# EAGLE schematic T06_preliminarySchematic_v3 (EAGLE 7.4.0)
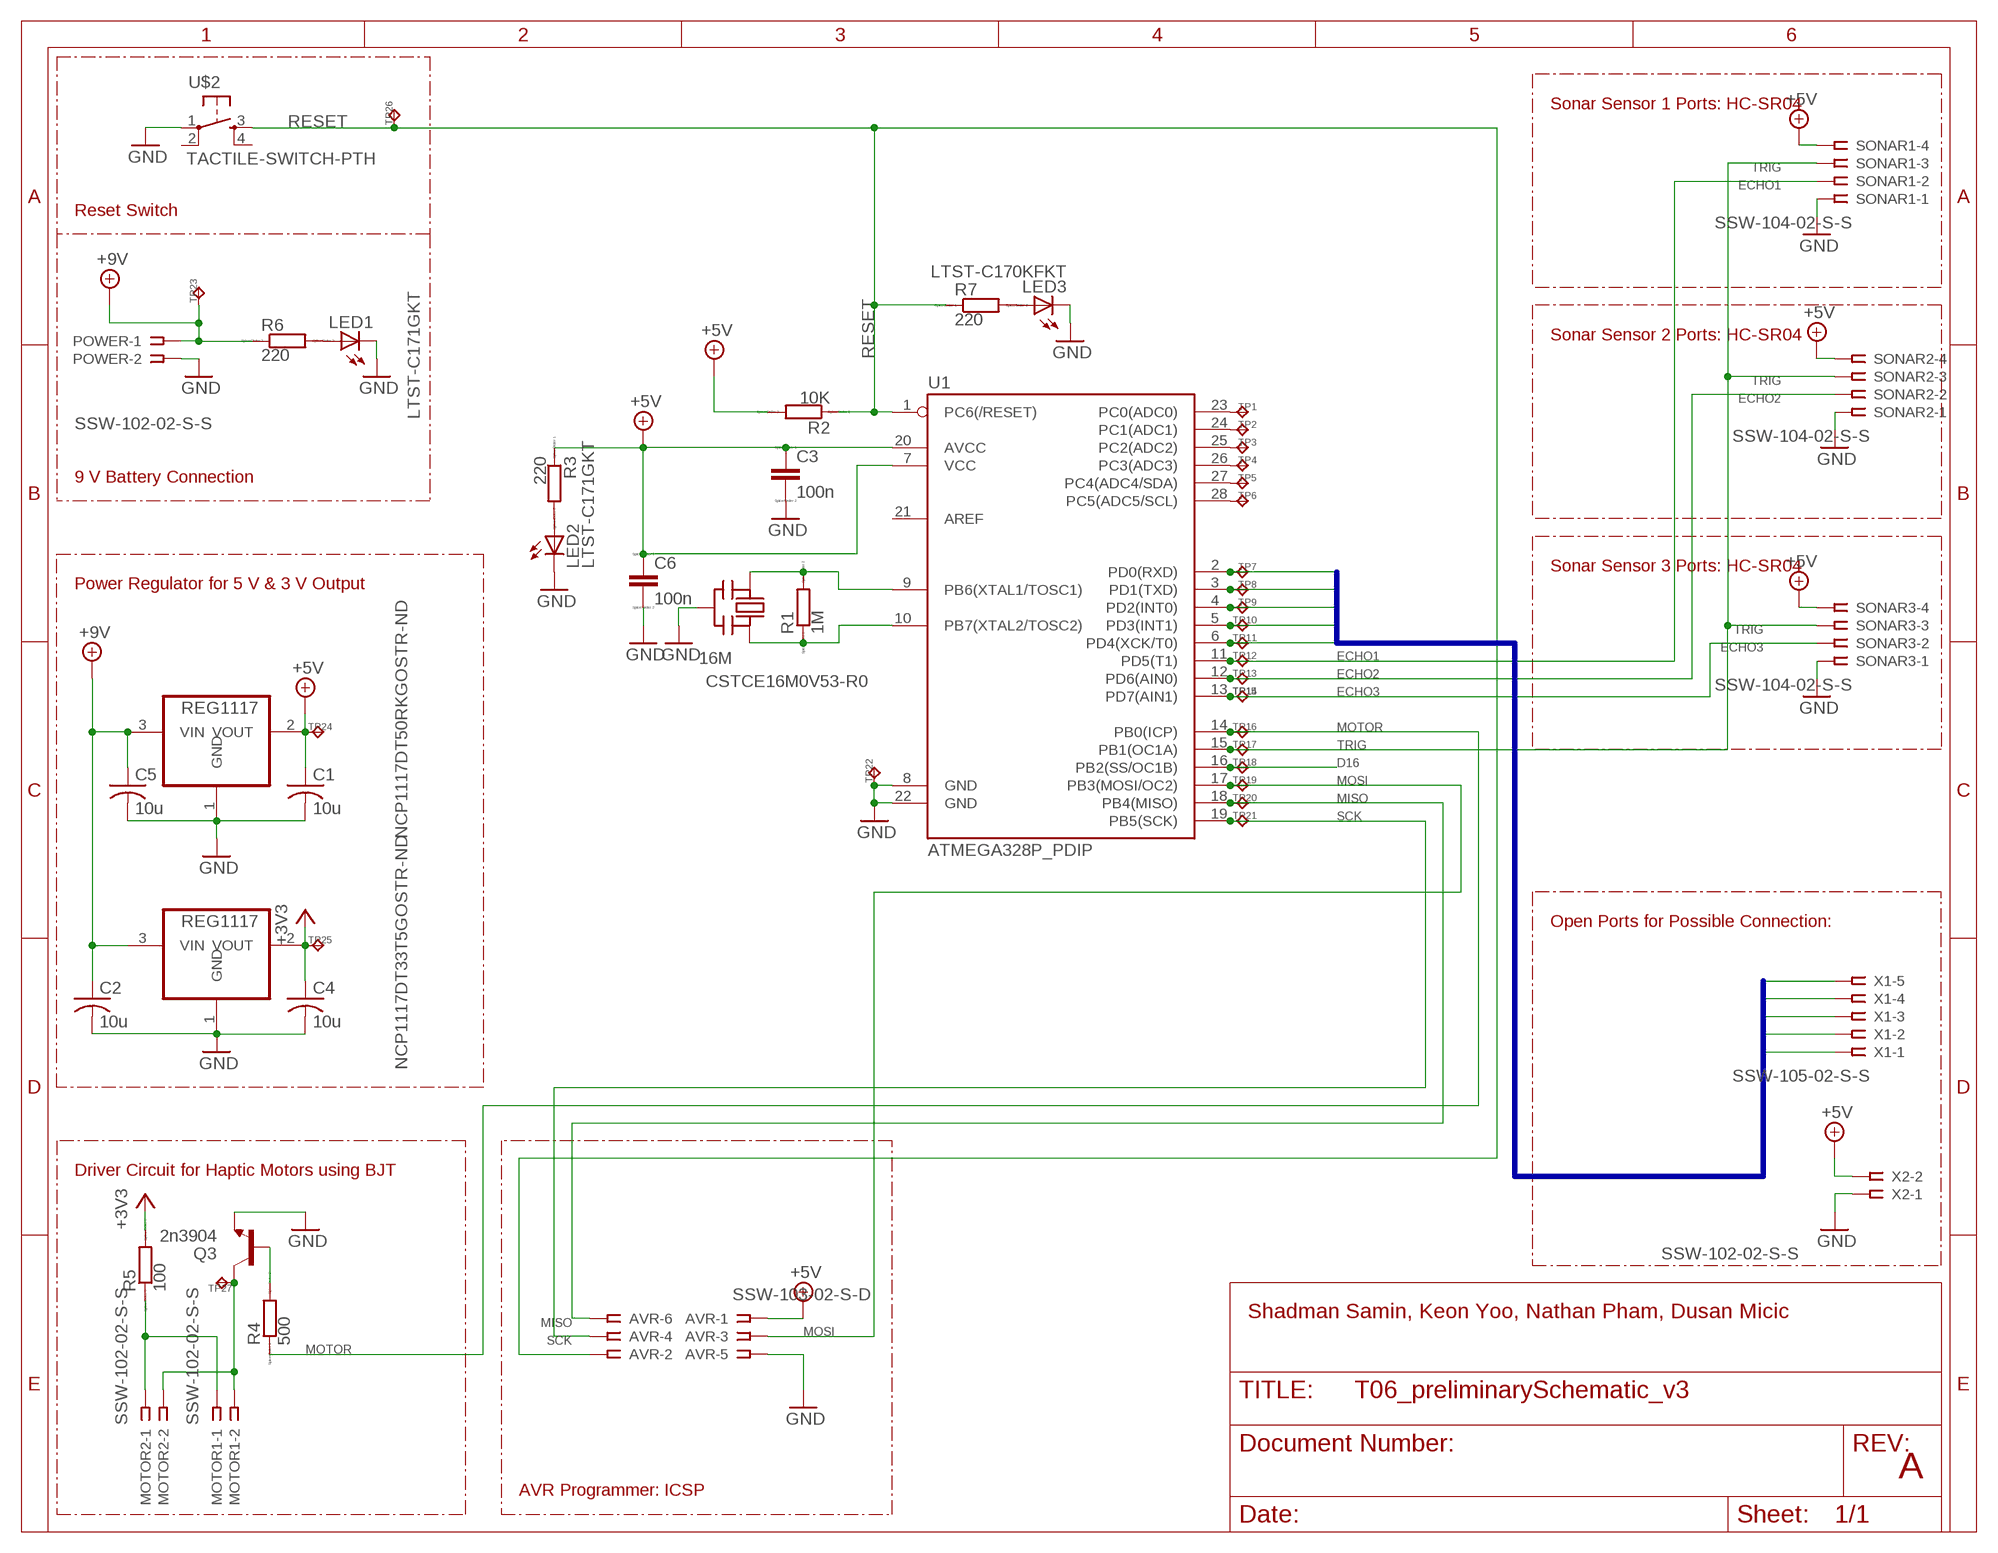
[diagram p0: schematic, sheet 1]

## Parts
AVR  SSW-103-02-S-D  [SSW-103-02-S-D]
C1  10u  C-USC0805K  [C0805K]
C2  10u  C-USC0805K  [C0805K]
C3  100n  CC1005  [C1005]
C4  10u  C-USC0805K  [C0805K]
C5  10u  C-USC0805K  [C0805K]
C6  100n  CC1005  [C1005]
CSTCE16M0V53-R0  16M  CERMOSCILL-CSTCRG  [CSTCR-G]
LED1  LTST-C171GKT  LEDCHIPLED_0805  [CHIPLED_0805]
LED2  LTST-C171GKT  LEDCHIP-LED0805  [CHIP-LED0805]
LED3  LTST-C170KFKT  LEDCHIP-LED0805  [CHIP-LED0805]
MOTOR1  SSW-102-02-S-S  [SSW-102-02-S-S]
MOTOR2  SSW-102-02-S-S  [SSW-102-02-S-S]
NCP1117DT33T5GOSTR-ND  REG1117  [SOT223]
NCP1117DT50RKGOSTR-ND  REG1117  [SOT223]
POWER  SSW-102-02-S-S  [SSW-102-02-S-S]
Q3  2n3904  TRANSISTOR_NPN2N3904  [TO-92]
R1  1M  RR0603  [R0603]
R2  10K  RR0603  [R0603]
R3  220  RR0603  [R0603]
R4  500  RR0603  [R0603]
R5  100  RR0603  [R0603]
R6  220  RR0603  [R0603]
R7  220  RR0603  [R0603]
SONAR1  SSW-104-02-S-S  [SSW-104-02-S-S]
SONAR2  SSW-104-02-S-S  [SSW-104-02-S-S]
SONAR3  SSW-104-02-S-S  [SSW-104-02-S-S]
TP1  TPPAD1-13  [P1-13]
TP2  TPPAD1-13  [P1-13]
TP3  TPPAD1-13  [P1-13]
TP4  TPPAD1-13  [P1-13]
TP5  TPPAD1-13  [P1-13]
TP6  TPPAD1-13  [P1-13]
TP7  TPPAD1-13  [P1-13]
TP8  TPPAD1-13  [P1-13]
TP9  TPPAD1-13  [P1-13]
TP10  TPPAD1-13  [P1-13]
TP11  TPPAD1-13  [P1-13]
TP12  TPPAD1-13  [P1-13]
TP13  TPPAD1-13  [P1-13]
TP14  TPPAD1-13  [P1-13]
TP15  TPPAD1-13  [P1-13]
TP16  TPPAD1-13  [P1-13]
TP17  TPPAD1-13  [P1-13]
TP18  TPPAD1-13  [P1-13]
TP19  TPPAD1-13  [P1-13]
TP20  TPPAD1-13  [P1-13]
TP21  TPPAD1-13  [P1-13]
TP22  TPPAD1-13  [P1-13]
TP23  TPPAD1-13  [P1-13]
TP24  TPPAD1-13  [P1-13]
TP25  TPPAD1-13  [P1-13]
TP26  TPPAD1-13  [P1-13]
TP27  TPPAD1-13  [P1-13]
U1  ATMEGA328P_PDIP  [DIL28-3]
U$2  TACTILE-SWITCH-PTH  [TAC-SWITCH-PTH]
X1  SSW-105-02-S-S  [SSW-105-02-S-S]
X2  SSW-102-02-S-S  [SSW-102-02-S-S]

## Nets
+3V3: C4.1 NCP1117DT33T5GOSTR-ND.2(VOUT) R5.2 TP25.TP
+5V: AVR.1 C1.1 C3.1 C6.1 NCP1117DT50RKGOSTR-ND.2(VOUT) R2.2 R3.1 SONAR1.4 SONAR2.4 SONAR3.4 TP24.TP U1.7(VCC) U1.20(AVCC) X2.2
+9V: C2.1 C5.1 NCP1117DT33T5GOSTR-ND.3(VIN) NCP1117DT50RKGOSTR-ND.3(VIN) POWER.1 R6.1 TP23.TP
BU0: TP7.TP U1.2(PD0(RXD)) X1.1
BU1: TP8.TP U1.3(PD1(TXD)) X1.2
BU2: TP9.TP U1.4(PD2(INT0)) X1.3
BU3: TP10.TP U1.5(PD3(INT1)) X1.4
BU4: TP11.TP U1.6(PD4(XCK/T0)) X1.5
D16: TP18.TP U1.16(PB2(SS/OC1B))
ECHO1: SONAR1.2 TP12.TP U1.11(PD5(T1))
ECHO2: SONAR2.2 TP13.TP U1.12(PD6(AIN0))
ECHO3: SONAR3.2 TP14.TP TP15.TP U1.13(PD7(AIN1))
GND: AVR.5 C1.2 C2.2 C3.2 C4.2 C5.2 C6.2 CSTCE16M0V53-R0.2(GND) LED1.C LED2.C LED3.C NCP1117DT33T5GOSTR-ND.1(GND) NCP1117DT50RKGOSTR-ND.1(GND) POWER.2 Q3.1(E) SONAR1.1 SONAR2.1 SONAR3.1 TP22.TP U1.8(GND) U1.22(GND) U$2.1 X2.1
MISO: AVR.6 TP20.TP U1.18(PB4(MISO))
MOSI: AVR.3 TP19.TP U1.17(PB3(MOSI/OC2))
MOTOR: R4.1 TP16.TP U1.14(PB0(ICP))
N$1: CSTCE16M0V53-R0.3(OUT) R1.1 U1.10(PB7(XTAL2/TOSC2))
N$2: CSTCE16M0V53-R0.1(IN) R1.2 U1.9(PB6(XTAL1/TOSC1))
N$3: TP1.TP U1.23(PC0(ADC0))
N$4: TP2.TP U1.24(PC1(ADC1))
N$5: MOTOR1.1 MOTOR2.1 R5.1
N$6: TP3.TP U1.25(PC2(ADC2))
N$7: LED1.A R6.2
N$8: LED2.A R3.2
N$9: LED3.A R7.2
N$10: Q3.2(B) R4.2
N$11: MOTOR1.2 MOTOR2.2 Q3.3(C) TP27.TP
N$12: TP4.TP U1.26(PC3(ADC3))
N$13: TP5.TP U1.27(PC4(ADC4/SDA))
N$14: TP6.TP U1.28(PC5(ADC5/SCL))
RESET: AVR.2 R2.1 R7.1 TP26.TP U1.1(PC6(/RESET)) U$2.3
SCK: AVR.4 TP21.TP U1.19(PB5(SCK))
TRIG: SONAR1.3 SONAR2.3 SONAR3.3 TP17.TP U1.15(PB1(OC1A))
Unconnected: U1.21(AREF) U$2.2 U$2.4

## Buses
BU[0..4]

## Notes on the sheet
- Sonar Sensor 1 Ports: HC-SR04
- Reset Switch
- Sonar Sensor 2 Ports: HC-SR04
- 9 V Battery Connection
- Sonar Sensor 3 Ports: HC-SR04
- Power Regulator for 5 V & 3 V Output
- Open Ports for Possible Connection:
- Driver Circuit for Haptic Motors using BJT
- Shadman Samin, Keon Yoo, Nathan Pham, Dusan Micic
- A
- AVR Programmer: ICSP

## Library data of the parts
AVR = con-samtec:SSW-103-02-S-D: THROUGH-HOLE .025" SQ POST SOCKET Source: Samtec SSW.pdf; MPN: SSW-103-02-S-D; OC_FARNELL: unknown; OC_NEWARK: 11P9365
C1 C2 C4 C5 = adafruit:C-US: CAPACITOR, American symbol
C3 C6 = eagle-ltspice:C: CAPACITOR, European symbol; SPICEMODEL: NONE; SPICEPREFIX: C
CSTCE16M0V53-R0 = adafruit:CERMOSCILL: Ceramic oscillator with built in capacitors such as ZTT-12MHz http://www.ladyada.net/library/eagle
LED1-LED3 = adafruit:LED: LED OSRAM: - CHIPLED LG R971, LG N971, LY N971, LG Q971, LY Q971, LO R971, LY R971 LH N974, LH R974 LS Q976, LO Q976, LY Q976 LO Q996 - Hyper CHIPLED LW Q18S LB Q993, LB Q99A, LB R99A - SideLED LS A670, LO A670, LY A670, LG A670, LP A670 LB A673, LV A673, LT A673, LW A673 LH A674 LY A675 LS A676, LA A676, LO A676, LY A676, LW A676 LS A679, LY A679, LG A679 - Hyper Micro SIDELED® LS Y876, LA Y876, LO Y876, LY Y876 LT Y87S - SmartLED LW L88C, LW L88S LB L89C, LB L89S, LG L890 LS L89K, LO L89K, LY L89K LS L896, LA L896, LO L896, LY L896 - TOPLED LS T670, LO T670, LY T670, LG T670, LP T670 LSG T670, LSP T670, LSY T670, LOP T670, LYG T670 LG T671, LOG T671, LSG T671 LB T673, LV T673, LT T673, LW T673 LH T674 LS T676, LA T676, LO T676, LY T676, LB T676, LH T676, LSB T676, LW T676 LB T67C, LV T67C, LT T67C, LS T67K, LO T67K, LY T67K, LW E67C LS E67B, LA E67B, LO E67B, LY E67B, LB E67C, LV E67C, LT E67C LW T67C LS T679, LY T679, LG T679 LS T770, LO T770, LY T770, LG T770, LP T770 LB T773, LV T773, LT T773, LW T773 LH T774 LS E675, LA E675, LY E675, LS T675 LS T776, LA T776, LO T776, LY T776, LB T776 LHGB T686 LT T68C, LB T68C - Hyper Mini TOPLED® LB M676 - Mini TOPLED Santana® LG M470 LS M47K, LO M47K, LY M47K Source: http://www.osram.convergy.de/
MOTOR1 MOTOR2 POWER X2 = con-samtec:SSW-102-02-S-S: THROUGH-HOLE .025" SQ POST SOCKET Source: Samtec SSW.pdf; MPN: SSW-102-02-S-S; OC_FARNELL: unknown; OC_NEWARK: 11P9351
NCP1117DT33T5GOSTR-ND NCP1117DT50RKGOSTR-ND = burr-brown:REG1117: 800mA and 1A Low Dropout (LDO) Positive Regulator 1.8V, 2.5V, 2.85V, 3.3V, 5V, and Adj; MPN: REG1117; OC_FARNELL: 1097566; OC_NEWARK: 14P6981
Q3 = SparkFun-DiscreteSemi:TRANSISTOR_NPN: Generic NPN BJT MMBT2222A - TRANS-08049 (SOT-23, 1A 40V) MPSA42 - TRANS-09116 (SOT-23, 500mA 300V) MMBT5088LT1G - TRANS-11160 (SOT-23, 50 mA 30V) BC547 - COM-08928 <http://www.sparkfun.com/products/8928> (TO-92 45V 100mA) (1.Collector 2.Base 3.Emitter) 2N3904 - COM-00521 <http://www.sparkfun.com/products/521> (TO-92 40V 200mA) (1.Emitter 2.Base 3.Collector) P2N2222A - COM-12852 <http://www.sparkfun.com/products/12852> (TO-92 40V 600mA) (1.Collector 2.Base 3.Emitter); PROD_ID: TRANS-08447
R1-R7 = eagle-ltspice:R: RESISTOR, European symbol; SPICEMODEL: NONE; SPICEPREFIX: R
SONAR1-SONAR3 = con-samtec:SSW-104-02-S-S: THROUGH-HOLE .025" SQ POST SOCKET Source: Samtec SSW.pdf; MPN: SSW-104-02-S-S; OC_FARNELL: unknown; OC_NEWARK: 11P9384
TP1-TP27 = testpad:TP: Test pad
U1 = SparkFun-DigitalIC:ATMEGA328P_PDIP: uC used in the Arduino 32kb flash, 1k EEPROM, 2k SRAM This is the through-hole version of this chip.
U$2 = GeekAmmo:TACTILE-SWITCH: Tactile Switch 4 Pins, SPST NO
X1 = con-samtec:SSW-105-02-S-S: THROUGH-HOLE .025" SQ POST SOCKET Source: Samtec SSW.pdf; MPN: SSW-105-02-S-S; OC_FARNELL: unknown; OC_NEWARK: 11P9399

## Net classes
0 default: width 0.305 mm, drill 0.508 mm, clearance 0.254 mm